# EAGLE design Radio_RPI (EAGLE 7.4.0)
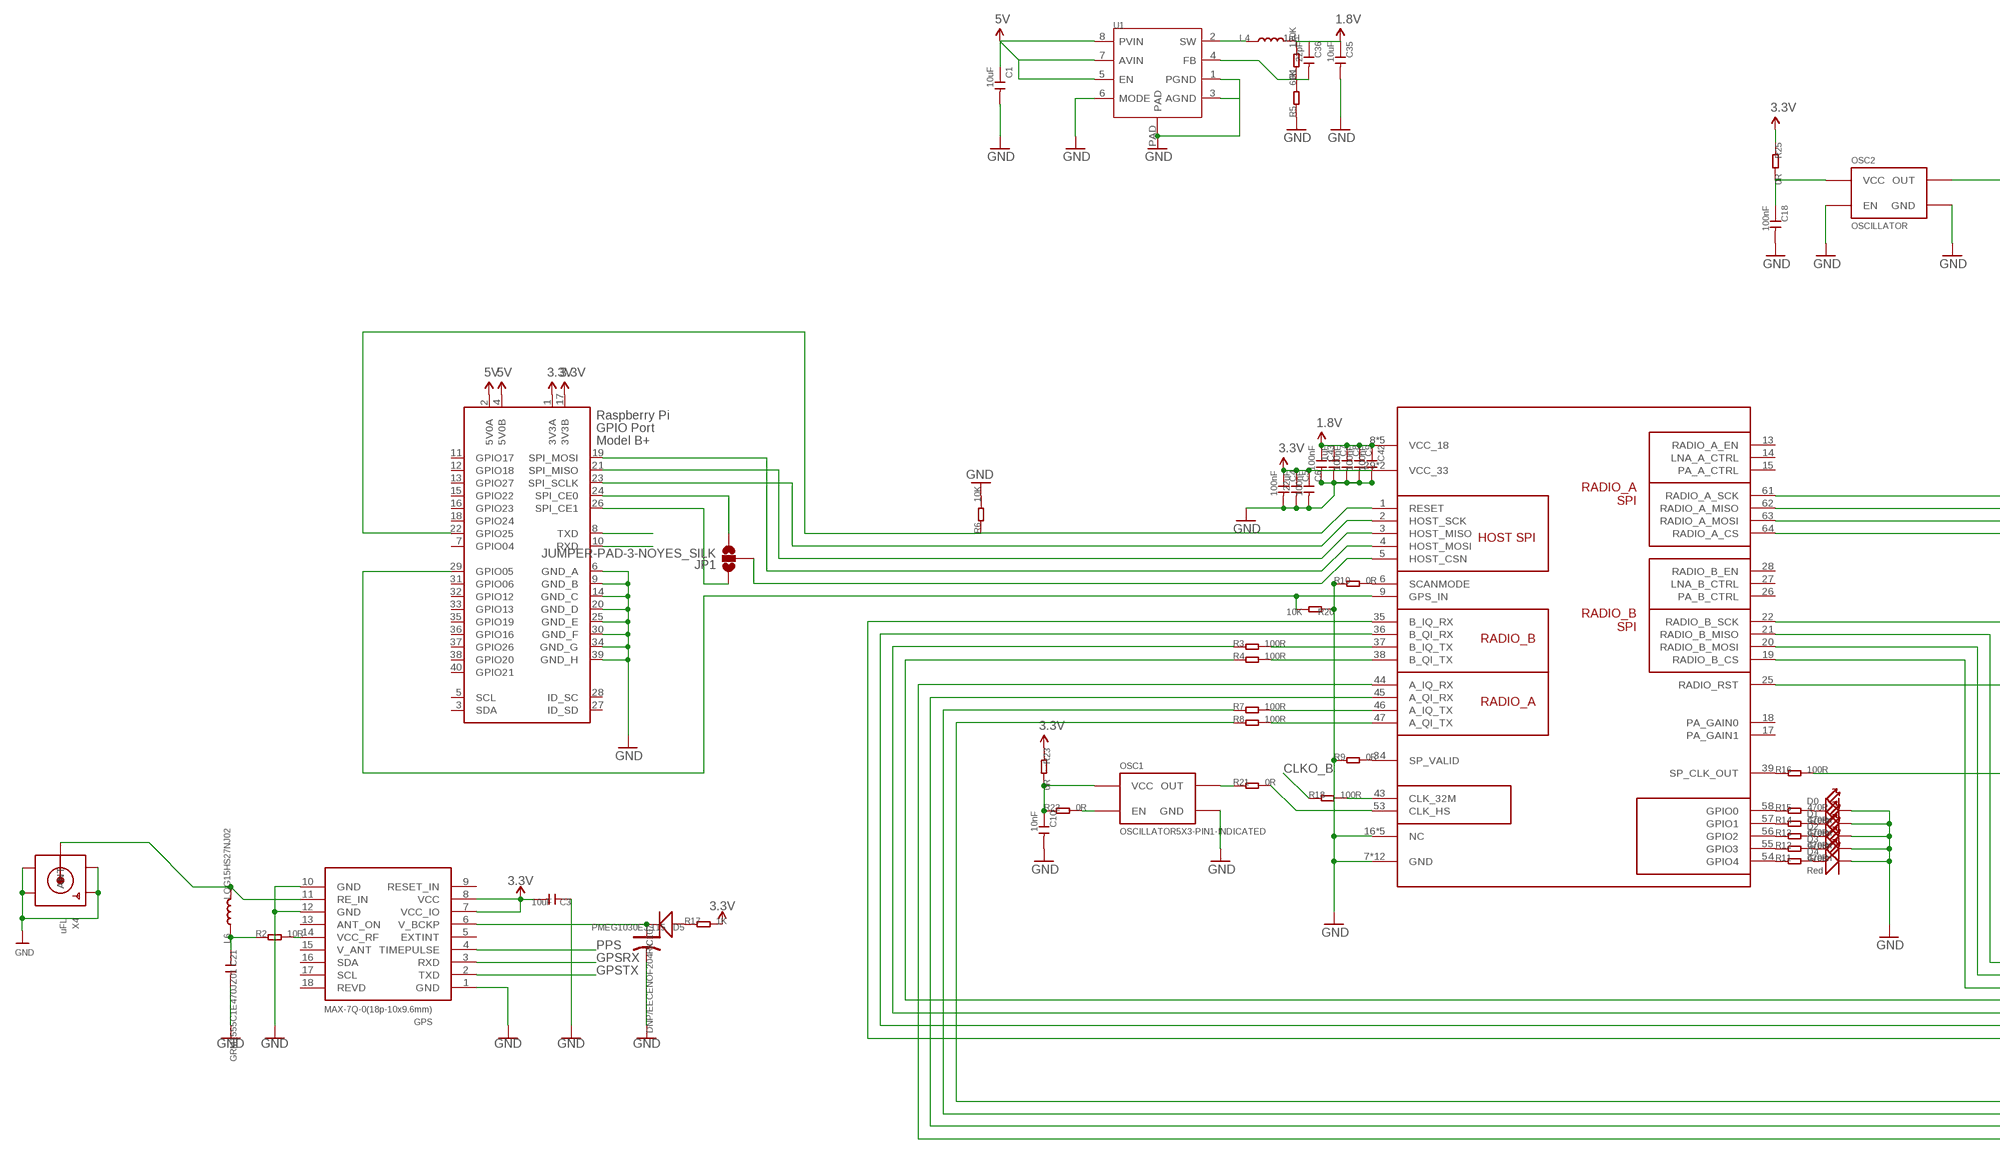
[diagram p0: schematic, sheet 1, part 1 of 2]
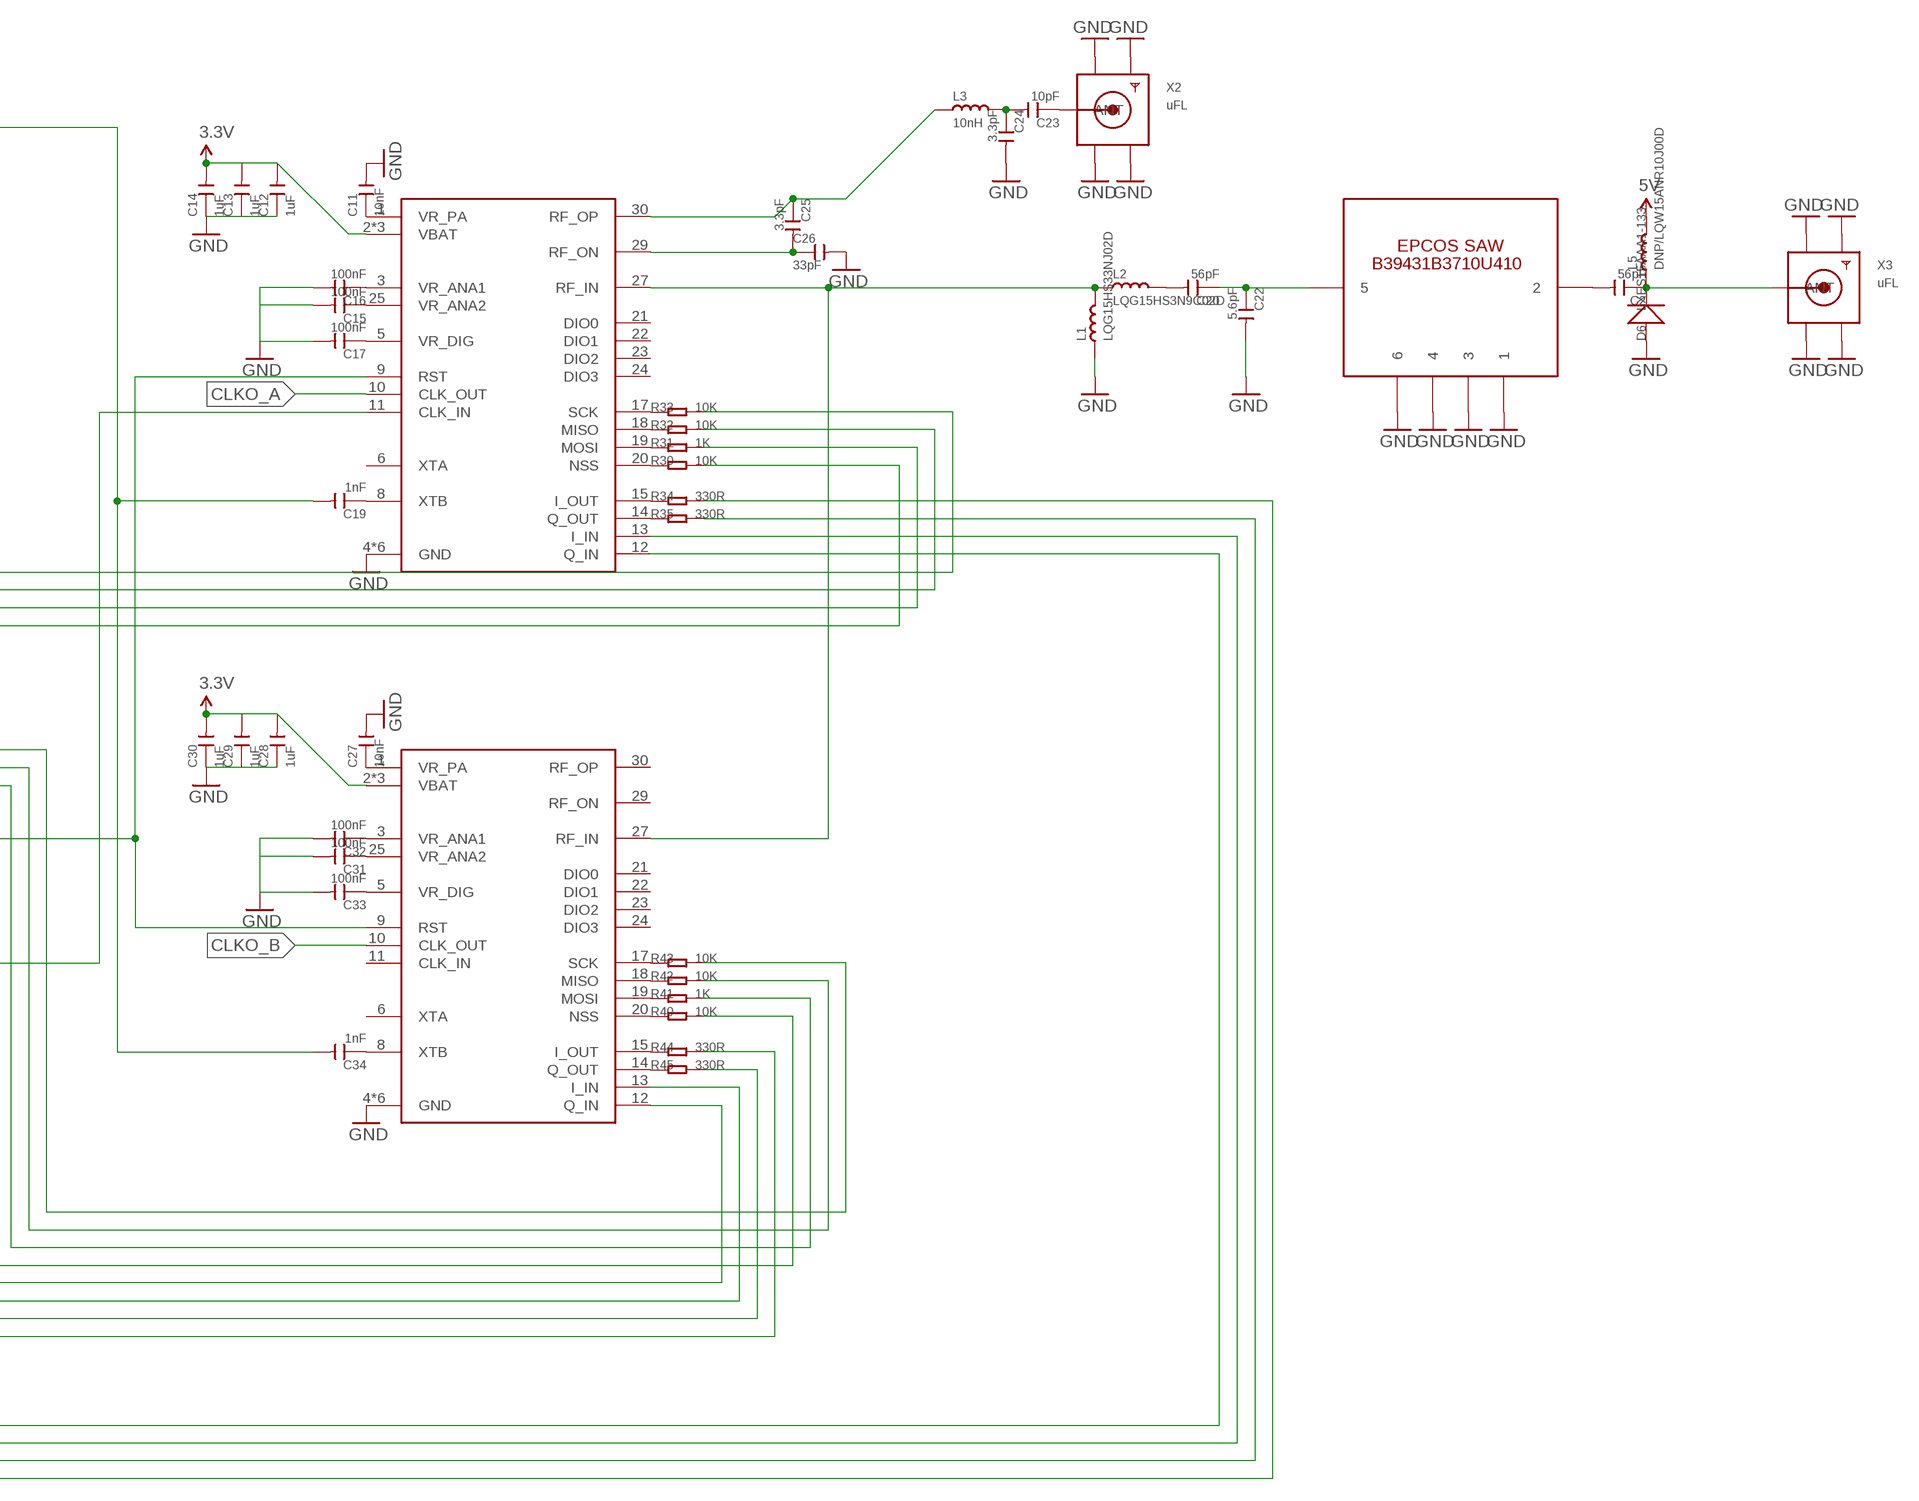
[diagram p1: schematic, sheet 1, part 2 of 2]

## Parts
C1  10uF  CAP-0603  [C0603@1]
C2  56pF  CAP-0402  [C0402@1]
C3  10uF  C-0603  [C0603]
C4  100nF  CAP-0402  [C0402@1]
C5  22uF  CAP-0603  [C0603@1]
C6  100nF  CAP-0402  [C0402@1]
C7  1uF  CAP-0402  [C0402@1]
C8  100nF  CAP-0402  [C0402@1]
C9  100nF  CAP-0402  [C0402@1]
C10  10nF  CAP-0402  [C0402@1]
C11  10nF  CAP-0402  [C0402@1]
C12  1uF  CAP-0402  [C0402@1]
C13  1uF  CAP-0402  [C0402@1]
C14  1uF  CAP-0402  [C0402@1]
C15  100nF  CAP-0402  [C0402@1]
C16  100nF  CAP-0402  [C0402@1]
C17  100nF  CAP-0402  [C0402@1]
C18  100nF  CAP-0402  [C0402@1]
C19  1nF  CAP-0402  [C0402@1]
C20  56pF  CAP-0402  [C0402@1]
C21  GRM1555C1E470JZ01  C-0402  [C0402]
C22  5.6pF  CAP-0402  [C0402@1]
C23  10pF  CAP-0402  [C0402@1]
C24  3.3pF  CAP-0402  [C0402@1]
C25  3.3pF  CAP-0402  [C0402@1]
C26  33pF  CAP-0402  [C0402@1]
C27  10nF  CAP-0402  [C0402@1]
C28  1uF  CAP-0402  [C0402@1]
C29  1uF  CAP-0402  [C0402@1]
C30  1uF  CAP-0402  [C0402@1]
C31  100nF  CAP-0402  [C0402@1]
C32  100nF  CAP-0402  [C0402@1]
C33  100nF  CAP-0402  [C0402@1]
C34  1nF  CAP-0402  [C0402@1]
C35  10uF  CAP-0603  [C0603@1]
C36  22pF  CAP-0402  [C0402@1]
C42  100nF  CAP-0402  [C0402@1]
C43  100nF  CAP-0402  [C0402@1]
C107  DNP/EECENOF204Rk  C-ELECTRIC-DOUBLE-LAYER-CAPACITOR  [2P-D6.8MMX1.8MMH]
D0  Green  LED-0603  [LED-0603]
D1  Green  LED-0603  [LED-0603]
D2  Green  LED-0603  [LED-0603]
D3  Green  LED-0603  [LED-0603]
D4  Red  LED-0603  [LED-0603]
D5  PMEG1030EJ,115  D'0805'  [SOD323]
D6  LXES15AAA1-133  D  [C0402]
GPS  MAX-7Q-0(18p-10x9.6mm)  MODULE-GPS-SMD-MAX-7Q-0(18P-9.6X10MM)  [GPS18P-SMD-1.1-10X9.6MM]
JP1  JUMPER-PAD-3-NOYES_SILK  [PAD-JUMPER-3-NO_YES_SILK]
L1  LQG15HS33NJ02D  INDUCTOR/FERRITE-BEAD-0402  [L0402@1]
L2  LQG15HS3N9C02D  INDUCTOR/FERRITE-BEAD-0402  [L0402@1]
L3  10nH  INDUCTOR/FERRITE-BEAD-0402  [L0402@1]
L4  1uH  L'1616BZ'  [1616BZ]
L5  DNP/LQW15ANR10J00D  INDUCTOR/FERRITE-BEAD-0402  [L0402@1]
L6  LQG15HS27NJ02  L'0402'  [L0402]
OSC1  OSCILLATOR5X3-PIN1-INDICATED  [CRYSTAL-OSC-SMD-5X3]
OSC2  OSCILLATOR  [CRYSTAL-OSC-SMD-3.2X2.5]
R1  120K  R-0402  [R0402]
R2  10R  R-0402  [R0402]
R3  100R  R-0402  [R0402]
R4  100R  R-0402  [R0402]
R5  60K  R-0402  [R0402]
R6  10K  R-0402  [R0402]
R7  100R  R-0402  [R0402]
R8  100R  R-0402  [R0402]
R9  0R  R-0402  [R0402]
R10  0R  R-0402  [R0402]
R11  470R  R-0402  [R0402]
R12  470R  R-0402  [R0402]
R13  470R  R-0402  [R0402]
R14  470R  R-0402  [R0402]
R15  470R  R-0402  [R0402]
R16  100R  R-0402  [R0402]
R17  1K  R-0402  [R0402]
R18  100R  R-0402  [R0402]
R20  10K  R-0402  [R0402]
R21  0R  R-0402  [R0402]
R22  0R  R-0402  [R0402]
R23  0R  R-0402  [R0402]
R25  0R  R-0402  [R0402]
R30  10K  R-0402  [R0402]
R31  1K  R-0402  [R0402]
R32  10K  R-0402  [R0402]
R33  10K  R-0402  [R0402]
R34  330R  R-0402  [R0402]
R35  330R  R-0402  [R0402]
R40  10K  R-0402  [R0402]
R41  1K  R-0402  [R0402]
R42  10K  R-0402  [R0402]
R43  10K  R-0402  [R0402]
R44  330R  R-0402  [R0402]
R45  330R  R-0402  [R0402]
U1  PMIC-ETA3410D2I-T(DFN8-2X2)WSON  [WSON]
U$1  SX1301  [QFN64G-0.5-9X9MM]
U$2  SX1255  [QFN32G-0.5-5X5MM]
U$3  SX1255  [QFN32G-0.5-5X5MM]
U$4  B39921B3728U410  EPCOS_SAW_FILTER  [EPCOS_SAW_FILTER]
X1  RASPI_BOARD_B+#_H  [RASPI_BOARD_B+HAT]
X2  uFL  SMACONNECTOR_EDGE_UFL  [SMA_EDGELAUNCH_UFL]
X3  uFL  SMACONNECTOR_EDGE_UFL  [SMA_EDGELAUNCH_UFL]
X4  uFL  SMACONNECTOR_EDGE_UFL  [SMA_EDGELAUNCH_UFL]

## Nets
1.8V: C7.1 C8.1 C9.1 C35.1 C36.1 C42.1 C43.1 L4.2 R1.2 U$1.8(VCC_18) U$1.12(VCC_18) U$1.23(VCC_18) U$1.42(VCC_18) U$1.60(VCC_18)
3.3V: C3.2 C4.1 C5.1 C6.1 C12.2 C13.2 C14.2 C28.2 C29.2 C30.2 GPS.7(VCC_IO) GPS.8(VCC) R17.2 R23.1 R25.1 U$1.29(VCC_33) U$1.52(VCC_33) U$2.2(VBAT) U$2.16(VBAT) U$2.32(VBAT) U$3.2(VBAT) U$3.16(VBAT) U$3.32(VBAT) X1.1(3V3A) X1.17(3V3B)
5V: C1.1 L5.2 U1.5(EN) U1.7(AVIN) U1.8(PVIN) X1.2(5V0A) X1.4(5V0B)
CLKO_A: U$2.10(CLK_OUT)
CLKO_B: R18.1 U$3.10(CLK_OUT)
CS: JP1.2 U$1.5(HOST_CSN)
FEWF: D4.+ R11.2
GND: C1.2 C3.1 C4.2 C5.2 C6.2 C7.2 C8.2 C9.2 C10.2 C11.2 C12.1 C13.1 C14.1 C15.2 C16.2 C17.2 C18.2 C21.2 C22.2 C24.2 C26.2 C27.2 C28.1 C29.1 C30.1 C31.2 C32.2 C33.2 C35.2 C42.2 C43.2 C107.- D0.- D1.- D2.- D3.- D4.- D6.1(+) GPS.1(GND) GPS.10(GND) GPS.12(GND) L1.1 OSC1.2(GND) OSC2.P$1(EN) OSC2.P$2(GND) R5.1 R6.2 R9.1 R10.1 R20.1 U1.1(PGND) U1.3(AGND) U1.6(MODE) U1.PAD U$1.7(GND) U$1.10(GND) U$1.11(GND) U$1.16(NC) U$1.24(GND) U$1.30(GND) U$1.31(GND) U$1.32(NC) U$1.33(NC) U$1.40(GND) U$1.41(GND) U$1.48(NC) U$1.49(NC) U$1.50(GND) U$1.51(GND) U$1.59(GND) U$1.65(GND) U$2.4(GND) U$2.7(GND) U$2.26(GND) U$2.28(GND) U$2.31(GND) U$2.33(GND) U$3.4(GND) U$3.7(GND) U$3.26(GND) U$3.28(GND) U$3.31(GND) U$3.33(GND) U$4.P$1 U$4.P$3 U$4.P$4 U$4.P$6 X1.6(GND_A) X1.9(GND_B) X1.14(GND_C) X1.20(GND_D) X1.25(GND_E) X1.30(GND_F) X1.34(GND_G) X1.39(GND_H) X2.GND@1(GND1) X2.GND@2(GND2) X2.GND@3(GND3) X2.GND@4(GND4) X3.GND@1(GND1) X3.GND@2(GND2) X3.GND@3(GND3) X3.GND@4(GND4) X4.GND@1(GND1) X4.GND@2(GND2) X4.GND@3(GND3) X4.GND@4(GND4)
GPSRX: GPS.3(RXD) X1.8(TXD)
GPSTX: GPS.2(TXD) X1.10(RXD)
MISO: U$1.3(HOST_MISO) X1.21(SPI_MISO)
MOSI: U$1.4(HOST_MOSI) X1.19(SPI_MOSI)
N$1: R30.1 U$2.20(NSS)
N$2: R45.2 U$1.36(B_QI_RX)
N$3: R3.2 U$1.37(B_IQ_TX)
N$4: R4.2 U$1.38(B_QI_TX)
N$5: R34.2 U$1.44(A_IQ_RX)
N$6: R7.2 U$1.46(A_IQ_TX)
N$7: R8.2 U$1.47(A_QI_TX)
N$8: R35.2 U$1.45(A_QI_RX)
N$9: R9.2 U$1.34(SP_VALID)
N$10: R10.2 U$1.6(SCANMODE)
N$11: C20.2 L2.2
N$12: R11.1 U$1.54(GPIO4)
N$13: R12.1 U$1.55(GPIO3)
N$14: R13.1 U$1.56(GPIO2)
N$15: R14.1 U$1.57(GPIO1)
N$16: R15.1 U$1.58(GPIO0)
N$17: C2.1 D6.2(-) L5.1 X3.P(ANT)
N$18: D3.+ R12.2
N$19: D1.+ R14.2
N$20: D0.+ R15.2
N$21: D2.+ R13.2
N$22: R16.1 U$1.39(SP_CLK_OUT)
N$24: C23.1 X2.P(ANT)
N$25: L4.1 U1.2(SW)
N$26: C36.2 R1.1 R5.2 U1.4(FB)
N$27: C21.1 L6.1 R2.1
N$28: JP1.3 X1.24(SPI_CE0)
N$29: C19.1 U$2.8(XTB)
N$30: R21.2 U$1.53(CLK_HS)
N$31: OSC1.3(OUT) R21.1
N$32: OSC1.1(EN) R22.2
N$33: C10.1 OSC1.4(VCC) R22.1 R23.2
N$34: GPS.14(VCC_RF) R2.2
N$35: C11.1 U$2.1(VR_PA)
N$36: C18.1 OSC2.P$4(VCC) R25.2
N$37: C19.2 C34.2 OSC2.P$3(OUT)
N$38: C15.1 U$2.25(VR_ANA2)
N$39: C16.1 U$2.3(VR_ANA1)
N$40: C17.1 U$2.5(VR_DIG)
N$41: GPS.11(RE_IN) L6.2 X4.P(ANT)
N$42: C107.+ D5.- GPS.6(V_BCKP)
N$43: D5.+ R17.1
N$44: C20.1 C22.1 U$4.P$5
N$45: R18.2 U$1.43(CLK_32M)
N$46: C2.2 U$4.P$2
N$49: L1.2 L2.1 U$2.27(RF_IN) U$3.27(RF_IN)
N$52: C23.2 C24.1 L3.2
N$53: C25.1 L3.1 U$2.30(RF_OP)
N$54: C25.2 C26.1 U$2.29(RF_ON)
N$56: R34.1 U$2.15(I_OUT)
N$57: R35.1 U$2.14(Q_OUT)
N$58: C27.1 U$3.1(VR_PA)
N$59: C31.1 U$3.25(VR_ANA2)
N$60: C32.1 U$3.3(VR_ANA1)
N$61: C33.1 U$3.5(VR_DIG)
N$62: C34.1 U$3.8(XTB)
N$78: R44.1 U$3.15(I_OUT)
N$79: R45.1 U$3.14(Q_OUT)
N$80: R33.2 U$1.61(RADIO_A_SCK)
N$81: R32.2 U$1.62(RADIO_A_MISO)
N$82: R31.2 U$1.63(RADIO_A_MOSI)
N$83: R30.2 U$1.64(RADIO_A_CS)
N$84: R43.2 U$1.22(RADIO_B_SCK)
N$85: R42.2 U$1.21(RADIO_B_MISO)
N$86: R41.2 U$1.20(RADIO_B_MOSI)
N$87: R40.2 U$1.19(RADIO_B_CS)
N$88: U$1.25(RADIO_RST) U$2.9(RST) U$3.9(RST)
N$89: R16.2 U$2.11(CLK_IN)
N$90: R44.2 U$1.35(B_IQ_RX)
N$91: R7.1 U$2.13(I_IN)
N$92: R3.1 U$3.13(I_IN)
N$93: R4.1 U$3.12(Q_IN)
N$94: R8.1 U$2.12(Q_IN)
N$95: JP1.1 X1.26(SPI_CE1)
N$100: R31.1 U$2.19(MOSI)
N$101: R32.1 U$2.18(MISO)
N$102: R33.1 U$2.17(SCK)
N$103: R40.1 U$3.20(NSS)
N$104: R41.1 U$3.19(MOSI)
N$105: R42.1 U$3.18(MISO)
N$106: R43.1 U$3.17(SCK)
PPS: GPS.4(TIMEPULSE) R20.2 U$1.9(GPS_IN) X1.29(GPIO05)
RST: R6.1 U$1.1(RESET) X1.22(GPIO25)
SCK: U$1.2(HOST_SCK) X1.23(SPI_SCLK)
Unconnected: GPS.5(EXTINT) GPS.9(RESET_IN) GPS.13(ANT_ON) GPS.15(V_ANT) GPS.16(SDA) GPS.17(SCL) GPS.18(REVD) U$1.13(RADIO_A_EN) U$1.14(LNA_A_CTRL) U$1.15(PA_A_CTRL) U$1.17(PA_GAIN1) U$1.18(PA_GAIN0) U$1.26(PA_B_CTRL) U$1.27(LNA_B_CTRL) U$1.28(RADIO_B_EN) U$2.6(XTA) U$2.21(DIO0) U$2.22(DIO1) U$2.23(DIO2) U$2.24(DIO3) U$3.6(XTA) U$3.11(CLK_IN) U$3.21(DIO0) U$3.22(DIO1) U$3.23(DIO2) U$3.24(DIO3) U$3.29(RF_ON) U$3.30(RF_OP) X1.3(SDA) X1.5(SCL) X1.7(GPIO04) X1.11(GPIO17) X1.12(GPIO18) X1.13(GPIO27) X1.15(GPIO22) X1.16(GPIO23) X1.18(GPIO24) X1.27(ID_SD) X1.28(ID_SC) X1.31(GPIO06) X1.32(GPIO12) X1.33(GPIO13) X1.35(GPIO19) X1.36(GPIO16) X1.37(GPIO26) X1.38(GPIO20) X1.40(GPIO21)

## Library data of the parts
C1 C2 C4-C20 C22-C36 C42 C43 = Discrete:CAP: Ceramic Capacitors
C3 C21 = Discrete:C*: Ceramic Capacitors
C107 = template:C-ELECTRIC-DOUBLE-LAYER-CAPACITOR: Electric Double Layer Capacitor DMS3R3204R,DMS3R3224R
D0 D1-D4 = Discrete:LED
D5 D6 = Discrete:D*
GPS = Seeed-OPL-Moudle:MODULE-GPS-SMD-MAX-7Q-0(18P-9.6X10MM): 317050009; MPN: MAX-7Q-0
JP1 = SparkFun-Passives:JUMPER-PAD-3-NO
L1-L3 L5 = Discrete:INDUCTOR/FERRITE-BEAD
L4 L6 = Discrete:L*
OSC1 OSC2 = SparkFun-FreqCtrl:OSCILLATOR: Generic 5x3 and 7x5 oscillators
R1-R18 R20-R23 R25 R30-R35 R40-R45 = Discrete:R*
U1 = Seeed-OPL-ic:PMIC-ETA3410D2I-T(DFN8-2X2): 310030161
U$1 = Seeed-OPL-ic:SX1301
U$2 U$3 = Seeed-OPL-ic:SX1255
U$4 = Ava:EPCOS_SAW_FILTER
X1 = raspberrypi_bastelstube_v13:RASPI_BOARD_B+#: Raspberry Pi GPIO connector with markings for the outer dimensions of the Raspberry Pi board model B+ with different sets of drill holes or mounting pads All pins connected
X2-X4 = microbuilder:SMACONNECTOR: SMA Connector 90° DIP SMA Connector, 50 Ohm (4UConnector: 07259)

## Board
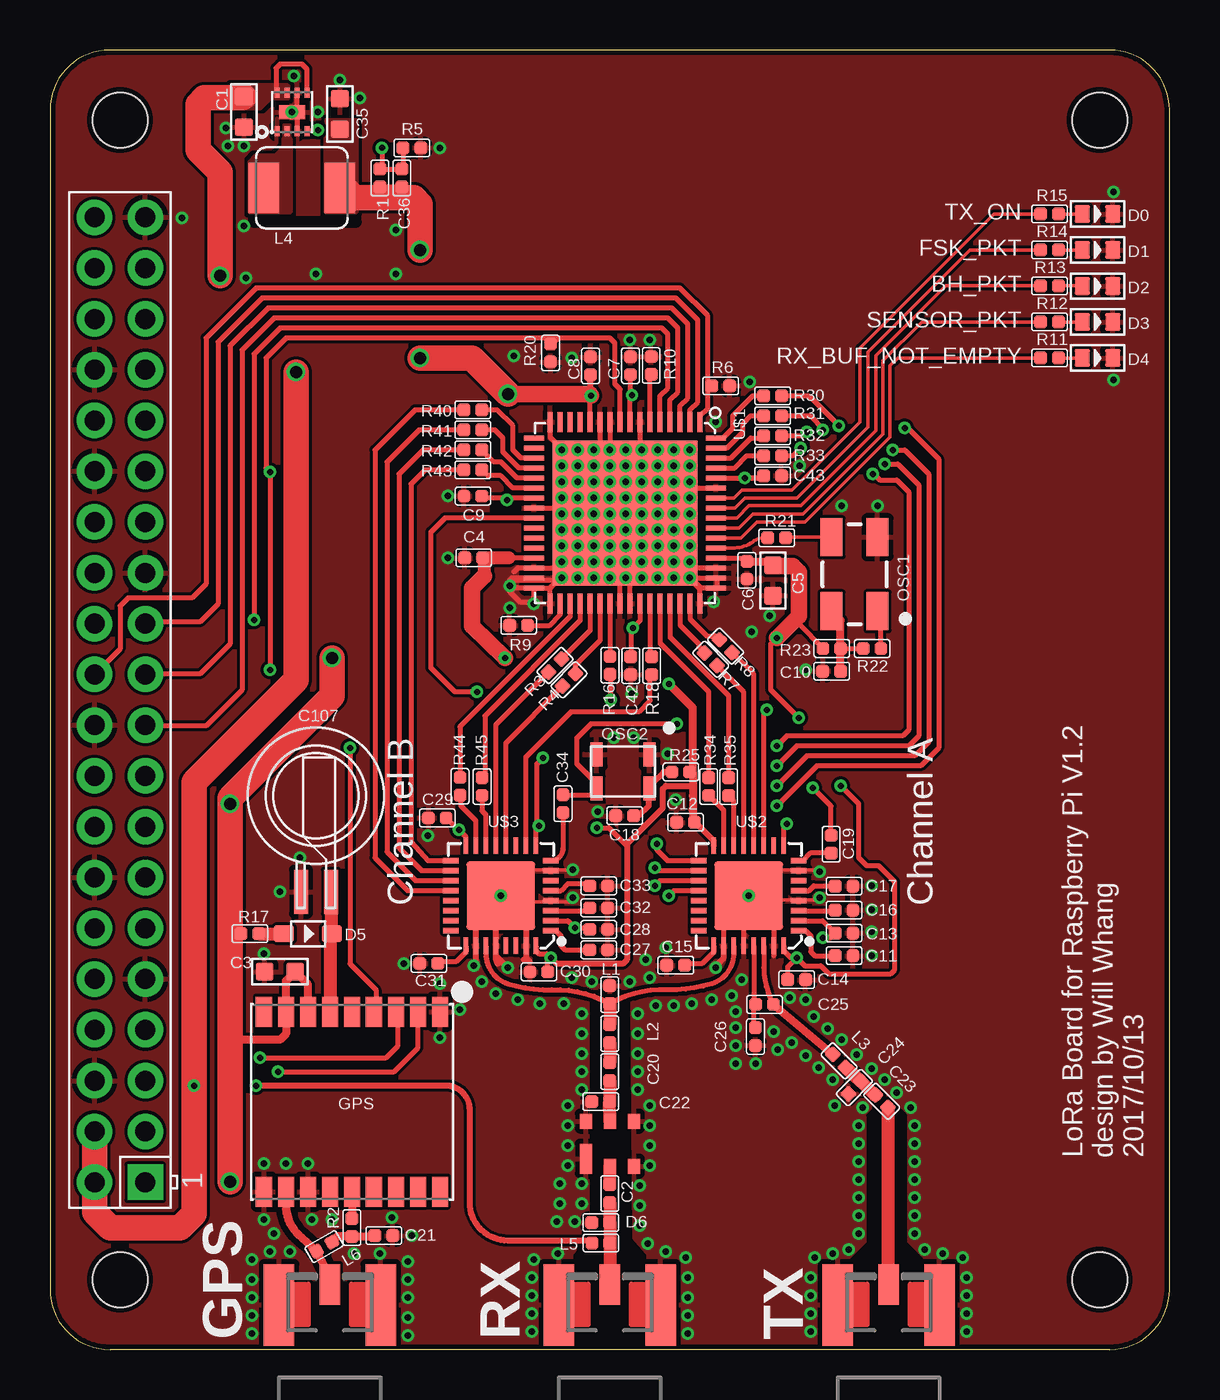
[diagram p2: board, top side]
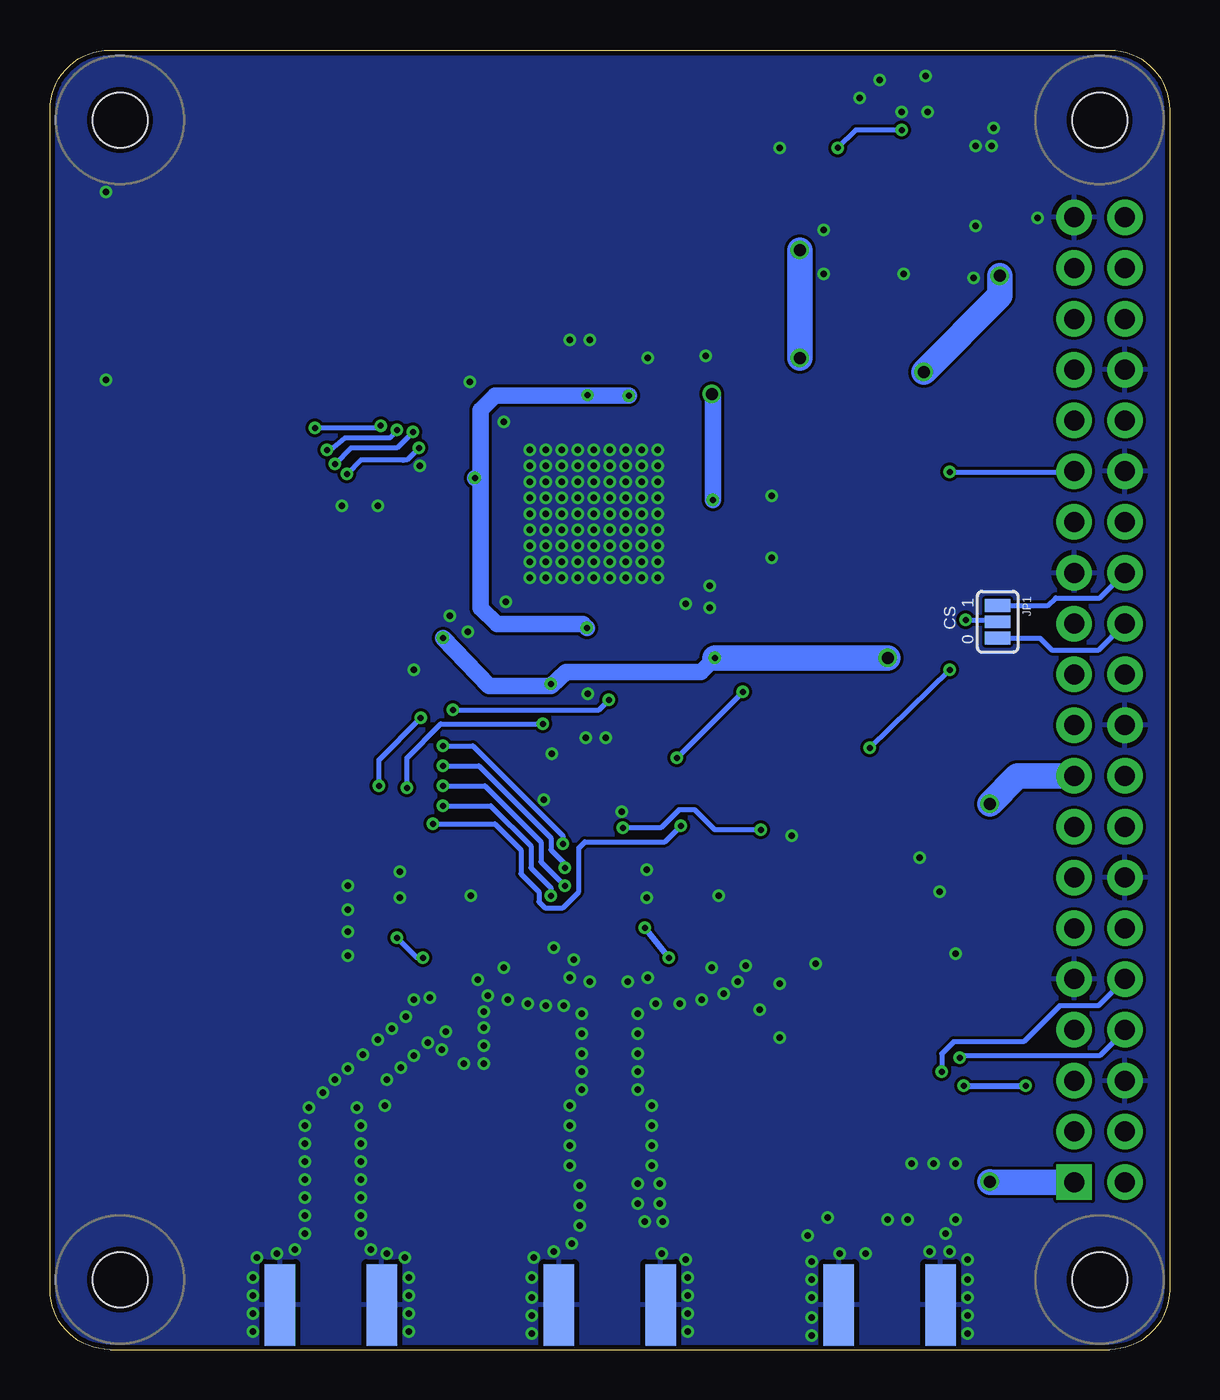
[diagram p3: board, bottom side, seen from below]

Size 56 x 65 mm. Coordinates in mm from the lower left corner, seen from the top.
Copper layers (1*16): Top 0.035mm / dielectric 1.5mm / Bottom 0.035mm
Design rules "SeeedStudio_2layer_DRU_no_angle_20140221 *": minimum track width 6mil, minimum drill 0.3mm, track to track 6mil, track to pad 6mil, pad to pad 6mil, via to via 6mil, smd to smd 0mil, copper to edge 10mil, drill to drill 10mil, minimum pad ring 10mil, minimum via ring 6mil, stop-mask expansion 2mil, vias tented up to drill 100mil, thermal gap 10mil
tRestrict: area 26.3,0.1 to 29.7,17.5; area 40.1,0.1 to 43.6,12; 31 lines

### Footprints (pad centres in the part's own frame; a part is rotated, then mirrored left to right if it is on the bottom)
C0603@1 = smd 0.889 x 0.889: 1 -0.762,0; 2 0.762,0
C0402@1 = smd 0.635 x 0.635: 1 -0.445,0; 2 0.445,0
C0603 = smd 0.889 x 0.889: 1 -0.762,0; 2 0.762,0
C0402 = smd 0.635 x 0.635: 1 -0.445,0; 2 0.445,0
2P-D6.8MMX1.8MMH = smd 2.2 x 0.7: + 4.8,0.75; - 4.8,-0.75
LED-0603 = smd 0.762 x 0.889: + -0.762,0; - 0.762,0
SOD323 = smd 1 x 0.8: + -1.2,0; - 1.2,0
GPS18P-SMD-1.1-10X9.6MM = smd 1.5 x 0.8: 1 -4.5,4.4; 2 -4.5,3.3; 3 -4.5,2.2; 4 -4.5,1.1; 5 -4.5,0; 6 -4.5,-1.1; 7 -4.5,-2.2; 8 -4.5,-3.3; 9 -4.5,-4.4; 10 4.5,-4.4; 11 4.5,-3.3; 12 4.5,-2.2; 13 4.5,-1.1; 14 4.5,0; 15 4.5,1.1; 16 4.5,2.2; 17 4.5,3.3; 18 4.5,4.4
PAD-JUMPER-3-NO_YES_SILK = smd 0.635 x 1.27: 1 -0.813,0; 2 0,0; 3 0.813,0
L0402@1 = smd 0.635 x 0.635: 1 -0.445,0; 2 0.445,0
1616BZ = smd 1.524 x 2.54: 1 -1.905,0; 2 1.905,0
L0402 = smd 0.635 x 0.635: 1 -0.445,0; 2 0.445,0
CRYSTAL-OSC-SMD-5X3 = smd 1.9 x 1.1: 1 -1.85,-1.15; 2 1.85,-1.15; 3 1.85,1.15; 4 -1.85,1.15
CRYSTAL-OSC-SMD-3.2X2.5 = smd 0.6 x 1.2: P$1 -1.325,-0.85; P$2 1.325,-0.85; P$3 1.325,0.85; P$4 -1.325,0.85
R0402 = smd 0.635 x 0.635: 1 -0.445,0; 2 0.445,0
WSON = smd 0.25 x 0.5: 1 -0.75,-0.95; 2 -0.25,-0.95; 3 0.25,-0.95; 4 0.75,-0.95; 5 0.75,0.95; 6 0.25,0.95; 7 -0.25,0.95; 8 -0.75,0.95 | smd 1.3 x 0.7: PAD 0,0
QFN64G-0.5-9X9MM = smd 1 x 0.25: 1 -4.55,3.75; 2 -4.55,3.25; 3 -4.55,2.75; 4 -4.55,2.25; 5 -4.55,1.75; 6 -4.55,1.25; 7 -4.55,0.75; 8 -4.55,0.25; 9 -4.55,-0.25; 10 -4.55,-0.75; 11 -4.55,-1.25; 12 -4.55,-1.75; 13 -4.55,-2.25; 14 -4.55,-2.75; 15 -4.55,-3.25; 16 -4.55,-3.75; 33 4.55,-3.75; 34 4.55,-3.25; 35 4.55,-2.75; 36 4.55,-2.25; 37 4.55,-1.75; 38 4.55,-1.25; 39 4.55,-0.75; 40 4.55,-0.25; 41 4.55,0.25; 42 4.55,0.75; 43 4.55,1.25; 44 4.55,1.75; 45 4.55,2.25; 46 4.55,2.75; 47 4.55,3.25; 48 4.55,3.75 | smd 0.25 x 1: 17 -3.75,-4.55; 18 -3.25,-4.55; 19 -2.75,-4.55; 20 -2.25,-4.55; 21 -1.75,-4.55; 22 -1.25,-4.55; 23 -0.75,-4.55; 24 -0.25,-4.55; 25 0.25,-4.55; 26 0.75,-4.55; 27 1.25,-4.55; 28 1.75,-4.55; 29 2.25,-4.55; 30 2.75,-4.55; 31 3.25,-4.55; 32 3.75,-4.55; 49 3.75,4.55; 50 3.25,4.55; 51 2.75,4.55; 52 2.25,4.55; 53 1.75,4.55; 54 1.25,4.55; 55 0.75,4.55; 56 0.25,4.55; 57 -0.25,4.55; 58 -0.75,4.55; 59 -1.25,4.55; 60 -1.75,4.55; 61 -2.25,4.55; 62 -2.75,4.55; 63 -3.25,4.55; 64 -3.75,4.55 | smd 7.25 x 7.25: 65 0,0
QFN32G-0.5-5X5MM = smd 0.813 x 0.279: 1 -2.5,1.75; 2 -2.5,1.25; 3 -2.5,0.75; 4 -2.5,0.25; 5 -2.5,-0.25; 6 -2.5,-0.75; 7 -2.5,-1.25; 8 -2.5,-1.75; 17 2.5,-1.75; 18 2.5,-1.25; 19 2.5,-0.75; 20 2.5,-0.25; 21 2.5,0.25; 22 2.5,0.75; 23 2.5,1.25; 24 2.5,1.75 | smd 0.279 x 0.813: 9 -1.75,-2.5; 10 -1.25,-2.5; 11 -0.75,-2.5; 12 -0.25,-2.5; 13 0.25,-2.5; 14 0.75,-2.5; 15 1.25,-2.5; 16 1.75,-2.5; 25 1.75,2.5; 26 1.25,2.5; 27 0.75,2.5; 28 0.25,2.5; 29 -0.25,2.5; 30 -0.75,2.5; 31 -1.25,2.5; 32 -1.75,2.5 | smd 3.429 x 3.429: 33 0,0
EPCOS_SAW_FILTER = smd 0.6 x 1.5: P$1 1.2,0.75 | smd 0.6 x 0.75: P$2 0,1.125; P$3 -1.2,1.125; P$4 -1.2,-1.125; P$5 0,-1.125; P$6 1.2,-1.125
RASPI_BOARD_B+HAT = drill 1 pad 1.778 square: 1 8.37,51.23 | drill 1 pad 1.778: 2 8.37,53.77; 3 10.91,51.23; 4 10.91,53.77; 5 13.45,51.23; 6 13.45,53.77; 7 15.99,51.23; 8 15.99,53.77; 9 18.53,51.23; 10 18.53,53.77; 11 21.07,51.23; 12 21.07,53.77; 13 23.61,51.23; 14 23.61,53.77; 15 26.15,51.23; 16 26.15,53.77; 17 28.69,51.23; 18 28.69,53.77; 19 31.23,51.23; 20 31.23,53.77; 21 33.77,51.23; 22 33.77,53.77; 23 36.31,51.23; 24 36.31,53.77; 25 38.85,51.23; 26 38.85,53.77; 27 41.39,51.23; 28 41.39,53.77; 29 43.93,51.23; 30 43.93,53.77; 31 46.47,51.23; 32 46.47,53.77; 33 49.01,51.23; 34 49.01,53.77; 35 51.55,51.23; 36 51.55,53.77; 37 54.09,51.23; 38 54.09,53.77; 39 56.63,51.23; 40 56.63,53.77 | hole 2.75: 3.5,3.5; 3.5,52.5; 61.5,3.5; 61.5,52.5
SMA_EDGELAUNCH_UFL = smd 4.064 x 1.524: GND@1 2.032,-2.54; GND@2 2.032,2.54 | smd 4.064 x 1.524 bottom: GND@3 2.032,2.54; GND@4 2.032,-2.54 | smd 2.032 x 1.016: P 3.048,0

### Placement (x,y rotation side)
C1  9.7,61.9 270 top
C2  28,7.8 90 top
C3  11.5,18.9 0 top
C4  21.19,39.6 180 top
C5  36.16,38.47 270 top
C6  34.86,38.98 270 top
C7  29.04,49.21 90 top
C8  27.04,49.2 90 top
C9  21.16,42.69 180 top
C10  39.1,33.93 180 top
C11  39.72,19.7 0 top
C12  31.79,26.37 0 top
C13  39.72,20.83 180 top
C14  37.35,18.5 180 top
C15  31.3,19.22 180 top
C16  39.72,21.98 0 top
C17  39.72,23.18 0 top
C18  28.75,26.7 180 top
C19  39.07,25.27 90 top
C20  28,13.9 90 top
C21  16.7,5.7 0 top
C22  27.55,12.4 180 top
C23  41.6,12.42 135 top
C24  40.24,13.1 225 top
C25  35.74,17.26 180 top
C26  35.29,15.65 270 top
C27  27.45,19.99 0 top
C28  27.45,21.01 180 top
C29  19.37,26.59 0 top
C30  24.46,18.89 0 top
C31  18.95,19.31 180 top
C32  27.45,22.09 0 top
C33  27.45,23.19 0 top
C34  25.66,27.3 90 top
C35  14.5,61.8 90 top
C36  17.6,58.6 90 top
C42  29.05,34.2 270 top
C43  36.15,43.7 0 top
C107  13.3,27.7 270 top
D0  52.4,56.8 0 top
D1  52.4,55 0 top
D2  52.4,53.19 0 top
D3  52.4,51.4 0 top
D4  52.4,49.6 0 top
D5  12.9,20.8 0 top
D6  27.55,6.35 0 top
GPS  15.1,12.4 270 top
JP1  8.6,36.4 270 bottom
L1  28,17.75 270 top
L2  28,15.8 270 top
L3  39.47,14.44 315 top
L4  12.6,58.1 0 top
L5  27.56,5.33 180 top
L6  13.71,5.15 210 top
OSC1  40.24,38.78 90 top
OSC2  28.67,28.92 180 top
R1  16.5,58.6 270 top
R2  15.1,6.1 90 top
R3  25.26,34.21 45 top
R4  25.96,33.5 45 top
R5  18.1,60.1 180 top
R6  33.55,48.2 0 top
R7  33.06,34.52 135 top
R8  33.79,35.19 135 top
R9  23.44,36.22 0 top
R10  30.07,49.22 270 top
R11  50,49.6 0 top
R12  50,51.4 0 top
R13  50,53.2 0 top
R14  50,55 0 top
R15  50,56.8 0 top
R16  28.01,34.22 270 top
R17  10,20.8 180 top
R18  30.1,34.2 90 top
R20  25.04,49.84 90 top
R21  36.35,40.6 180 top
R22  41.12,35.06 0 top
R23  39.11,35.06 0 top
R25  31.56,28.89 180 top
R30  36.15,47.7 180 top
R31  36.15,46.7 180 top
R32  36.15,45.7 180 top
R33  36.15,44.7 180 top
R34  32.95,28.16 90 top
R35  33.95,28.15 90 top
R40  21.15,47 0 top
R41  21.15,46 0 top
R42  21.15,45 0 top
R43  21.15,44 0 top
R44  20.51,28.17 90 top
R45  21.61,28.16 90 top
U1  12.1,61.9 0 top
U$1  28.77,41.85 270 top
U$2  34.95,22.7 180 top
U$3  22.55,22.7 180 top
U$4  28,10.3 180 top
X1  56,0 90 top
X2  41.95,0.2 90 top
X3  28,0.2 90 top
X4  14,0.2 90 top

### Tracks (layer width: path | path; a pad name or v marks a point on that pad's centre or on a via)
1.8V  (via drill 0.3, 0.6)
  Top 0.254: U$1.42 29.52,36.47 v29.15,36.1 29.05,36 C42.1 | U$1.23 22.95,42.6 | 22.95,42.6 21.71,42.6 C9.1 | U$1.8 29.02,47.67 29.05,47.7 | 29.05,47.7 v29.12,47.73 29.15,47.7 29.05,47.7 | C7.1 29.02,48.74 29.02,47.73 29.05,47.7 | U$1.12 27.02,48.74 C8.1 27.04,47.89 | 27.04,47.89 v27.05,47.7 | v27.05,47.7 27.05,47.5 | v27.05,47.7 27.05,47.9 27.04,47.89 | v22.85,42.5 22.95,42.6 | U$1.60 v34.75,43.6 | v34.75,43.6 35.6,43.6 C43.1 35.71,43.66 35.65,43.6 v34.75,43.6 | R1.2 C36.1
  Top 0.406: C36.1 17.6,57.7 17.7,57.6
  Top 0.813: v22.9,47.8 27,47.8 v27.05,47.7
  Top 1.27: L4.2 14.7,58.1 15.2,57.6 17.7,57.6 18.2,57.6 18.5,57.3 v18.5,55 | v18.5,49.6 21.1,49.6 v22.9,47.8
  Bottom 0.254: v29.12,47.73 27.08,47.73 v27.05,47.7
  Bottom 0.813: v22.85,42.5 22.85,47.7 v22.9,47.8 | v27.05,47.7 33.75,47.7 34.45,47 34.45,43.6 | v34.75,43.6 34.45,43.6 | 34.45,43.6 34.45,37.1 33.65,36.3 29.35,36.3 v29.15,36.1
  Bottom 1.27: v18.5,55 v18.5,49.6
  pour Top (no thermals): 13.8,61.5 15.3,61.5 15.3,56.9 13.8,56.9
3.3V  (via drill 0.3, 0.6)
  Top 0.254: U$2.2 38.66,21.45 C13.2 39.05,20.6 v38.65,20.6 | U$1.52 34.68,39.6 C6.1 | U$1.29 22.95,39.6 | U$3.2 25.9,21.45 v26.25,21.1 26.92,21.1 C28.2 | U$3.32 24.3,19.95 24.45,19.8 24.85,19.8 v25.05,19.6 24.89,19.45 C30.2 | 37.45,36.7 37.45,36.28 R23.1 | 32.15,27.7 32.05,27 32.15,26.9 | C12.2 32.18,26.37 32.15,26.4 | U$2.32 36.7,19.95 37.05,19.6 v37.35,19.6 | v37.35,19.6 36.91,19.16 C14.2 | v37.35,19.6 37.75,19.2 38.55,19.2 38.95,18.8 42.05,18.8 42.25,19 42.25,23.4 41.45,24.2 40.85,24.2 40.45,24.6 40.45,27.3 v39.55,28.2 | v37.45,31.6 36.05,33 36.05,35.3 v36.35,35.6 | C29.2 20.8,25.61 U$3.16 20.8,25.65 v20.45,26 | v27.35,26.1 27.95,26.1 28.85,25.2 | 21.7,39.58 21.65,39.58 C4.1
  Top 0.305: C12.2 32.28,26.37 | 31.91,28.9 R25.1 | U$2.16 33.2,25.45 32.28,26.37 | 32.28,26.37 32.25,26.4 | v25.05,19.6 25.35,19.3 28.65,19.3 28.85,19.5 28.85,25.2 28.85,25.3 30.65,27.1 30.65,28.05 30.8,28.2 32.15,28.2 | v26.25,21.1 26.25,21.25
  Top 0.406: C6.1 35.97,39.42 C5.1 | 32.15,28.9 32.15,28.2 32.15,27.7 32.15,26.9 32.15,26.4 32.15,26.3 | 31.91,28.9 32.15,28.9 | 32.15,28.9 32.15,32.1 v30.95,33.3 | GPS.7 12.9,18.26 C3.2 11.8,18.44 GPS.8 11.8,15.8 11.5,15.5 9,15.5
  Top 0.64: 21.7,39.58 21.7,38.7 | 22.95,39.6 C4.1 | R17.2 9.2,20.8 9,20.6
  Top 0.813: v36.35,35.6 37.45,36.7 37.45,38.9 37.15,39.2 36.19,39.2 C5.1 | v22.75,34.6 21.1,36.2 21.1,38.1 21.7,38.7
  Top 1.27: v9,8.4 9,15.5 9,20.6 v9,27.3 9,27.6 14.1,32.7 v14.1,34.6
  Bottom 0.254: v37.35,19.6 37.65,19.6 v38.65,20.6 | v39.55,28.2 39.55,29.5 v37.45,31.6 | v20.45,26 22.75,26 23.75,27 24.55,27 25.45,26.1 v27.35,26.1
  Bottom 0.305: v25.05,19.6 v26.25,21.1
  Bottom 0.406: v30.95,33.3 30.95,33.2
  Bottom 0.813: v22.75,34.6 23.45,33.9 30.2,33.9 30.95,33.2 34.05,33.2 v36.35,35.6
  Bottom 1.27: X1.1 8.97,8.37 v9,8.4 | v14.1,34.6 v22.75,34.6 | X1.17 7.61,28.69 v9,27.3
5V  (via drill 0.3, 0.6)
  Top 0.254: U1.5 12.85,64.05 12.6,64.3 11.5,64.3 11.3,64.1 11.3,62.9 U1.8
  Top 0.305: L5.2 26.89,5.45 22.9,5.45 arc-90 21,7.35 21,12 arc90 19.8,13.2 v10.3,13.2
  Top 1.27: X1.4 X1.2 2.23,6.87 3,6.1 6.5,6.1 7.2,6.8 v7.2,13.2 7.2,28.4 12.3,33.5 v12.3,48.9 | v8.5,53.7 8.5,58.9 7.4,60 7.4,62.3 7.7,62.6 9.64,62.6 C1.1
  Bottom 0.305: v10.3,13.2 v7.2,13.2
  Bottom 1.27: v12.3,48.9 8.5,52.7 v8.5,53.7
  pour Top (no thermals): 9.1,62.1 10.5,62.1 11,62.6 11.9,62.6 11.9,63.2 9.1,63.2
CLKO_B
  Top 0.254: U$3.10 23.8,29.65 26.05,31.9 29.45,31.9 30.02,32.47 30.02,33.67 R18.1
CS  (via drill 0.3)
  Top 0.254: U$1.5 30.52,47.72 30.9,48.1 30.9,50.8 30.6,51.1 11.5,51.1 10.2,49.8 v10.2,36.5
  Bottom 0.254: v10.2,36.5 8.8,36.5 8.7,36.4 JP1.2
FEWF
  Top 0.178: R11.2 D4.+
GND  (via drill 0.33)
  Top 0.178: 26.2,24 24.1,24 24,23.9 24,22.4 26.1,22.4 26.2,22.5 | 38.3,22.5 36.2,22.5 36.1,22.5 36.1,23.7 | 36.1,23.9 36.1,24 36.2,24 | 38.7,24 36.2,24 | 36.2,24 36.1,23.9 | 36.1,23.9 36.1,23.7 | 36.1,23.7 36.2,23.6 | 27.85,45.1 27.5,45.1 27.43,45.17
  Top 0.254: U$1.16 25.02,45.63 25.55,45.1 | U$1.11 27.52,45.27 27.43,45.17 27.35,45.1 25.55,45.1 | U$1.10 28.02,45.27 27.85,45.1 29.45,45.1 29.55,45.2 29.52,45.23 U$1.7 | U$1.24 25.85,42.1 | 25.85,42.1 25.85,39.3 | 25.85,39.3 25.65,39.1 U$1.30 23.4,39.1 23.2,38.9 | U$1.40 28.52,38.67 | 28.52,38.67 28.55,38.7 | 25.85,39.3 26.1,39.3 | 26.1,39.3 27.89,39.3 | 27.89,39.3 28.52,38.67 | 29.02,38.47 29.25,38.6 31.45,38.6 31.55,38.7 31.75,38.5 32.05,38.5 32.25,38.3 | U$1.48 32.52,38.03 32.25,38.3 | U$1.51 31.85,39.1 31.85,39 32.25,38.6 33.35,38.6 33.35,38.2 33.25,38.1 32.55,38.1 32.35,38.3 32.25,38.3 | U$1.41 29.02,38.47 | 29.02,38.47 29.02,38.57 29.15,38.7 29.15,41.2 28.65,41.7 28.65,41.8 28.75,41.9 | 25.55,45.1 25.55,42.4 25.85,42.1 | 27.89,39.3 27.89,40.97 U$1.65 30.7,41.85 31.95,43.1 U$1.59 33.35,43.1 | U$2.26 33.7,21.5 34.7,21.5 | 34.7,20 34.7,21.5 | 34.7,21.5 36.2,21.5 | 36.2,21.5 36.2,19.7 | 36.2,21.5 36.2,22.5 | U$1.31 23.1,38.6 23,38.5 25.3,38.5 26.1,39.3 | U$1.32 23.2,38.1 23,37.9 23.5,37.4 24.1,37.4 24.2,37.5 24.2,38 24.3,38.1 25,38.1 | 25,37.3 25,38.1 | 25,38.1 25.5,38.6 | C4.2 20.7,39.6 | 12.35,61.9 U1.3 | U1.PAD 12.35,61.9 | 12.35,61.9 U1.6
  Top 0.305: v33.3,19.1 33.3,19.2 33.7,19.6 U$2.26 | 22.7,19.3 22.4,19.6 | 22.3,19.7 22.3,19.6 arc37 22.4,19.3 22.4,19.6 | 22.4,19.6 22.3,19.7 | 22.3,19.7 22.3,21.3 22.5,21.5 21.3,21.5 21.3,21.3 | 21.3,19.4 21.3,19.3 v21.2,19.2 21.2,19.3 21.3,19.4 | 21.3,19.4 21.3,21.3 | 21.3,21.3 21.4,21.4 23.7,21.4 23.8,21.3 | 23.8,21.3 23.8,19.6 | 23.7,19.5 23.8,19.6 | 24,19.4 23.8,19.6 | 23.8,21.3 23.8,22.3 24,22.5 | 24,22.5 24,22.4 | 24,22.5 24,23.8 24.1,23.9
  other vias: 41.1,19.7 25.5,8.3 6.6,56.6 9.7,56.2 41.1,20.9 41.1,22 41.1,23.2 37.8,17.5 38.5,23.9 34.95,22.7 22.55,22.7 18.9,25.7 17.7,19.3 28.2,30.6 29.2,30.6 30.9,29.8 29.1,32.8 36,36.7 35.1,35.9 33.2,37.4 37.8,34 41.4,42.2 39.6,42.2 29,50.5 30,50.5 26.1,49.6 19.5,60.1 13.4,61.9 14.5,63.5 15.5,62.6 8.8,61.1 9.7,60.2 8.9,60.2 22.3,17.8 23.4,17.5 24.5,17.3 25.7,17.3 26.6,16.8 26.6,15.8 26.6,14.8 26.6,13.9 30.8,20.1 29.8,19.5 38.5,22.6 26.6,7.3 25.35,6.4 29.5,6.2 29.9,5.3 29.5,8.2 26.6,13 25.9,12.2 25.9,10.2 25.9,9.2 25.9,11.2 26.6,8.3 25.4,4.8 24.2,4.5 24.1,3.6 24.1,2.7 24.1,1.8 24.1,0.9 34.6,18.5 34.1,17.7 33.1,17.5 32.1,17.3 31.2,17.2 29.4,16.8 29.4,15.8 29.4,14.8 29.4,13.9 29.4,13 30,12.2 30,11.2 30,10.2 30,9.2 29.5,7.2 30.8,4.9 31.8,4.6 31.9,3.6 31.9,2.6 31.9,1.7 31.9,0.8 34.3,15.2 34.3,16.1 34.3,16.9 35.3,14.3 34.3,14.3 36.2,15.9 36.4,15 37.1,15.35 39.15,13.5 39.25,12.2 40.65,12.1 40.45,11.2 40.45,10.3 40.45,9.4 40.45,8.5 40.45,7.6 40.45,6.7 40.45,5.8 39.95,5 39.15,4.8 38.25,4.6 38.05,3.6 38.05,2.7 38.05,1.8 38.05,0.9 45.85,0.9 45.85,1.8 45.85,2.7 45.85,3.6 45.65,4.6 44.65,4.8 43.75,5 43.25,5.8 43.25,6.7 43.25,7.6 43.25,8.5 43.25,9.4 43.25,10.3 43.25,11.2 43.05,12.1 42.35,12.85 41.75,13.5 38.45,14.1 41.1,14.05 37.8,14.7 40.35,14.75 39.6,15.5 19.9,39.6 26.15,22.6 26.15,24 24.2,37.3 23,38.2 25.6,45 25.6,44.2 26.4,45 26.4,44.2 25.6,43.4 26.4,43.4 27.2,45 27.2,44.2 28,45 28,44.2 27.2,43.4 28,43.4 28.8,45 28.8,44.2 29.6,45 29.6,44.2 28.8,43.4 29.6,43.4 30.4,45 30.4,44.2 31.2,45 31.2,44.2 30.4,43.4 31.2,43.4 32,45 32,44.2 32,43.4 25.6,40.2 25.6,39.4 26.4,40.2 26.4,39.4 25.6,38.6 26.4,38.6 27.2,40.2 27.2,39.4 28,40.2 28,39.4 27.2,38.6 28,38.6 28.8,40.2 28.8,39.4 29.6,40.2 29.6,39.4 28.8,38.6 29.6,38.6 30.4,40.2 30.4,39.4 31.2,40.2 31.2,39.4 30.4,38.6 31.2,38.6 32,40.2 32,39.4 32,38.6 25.6,42.6 25.6,41.8 26.4,42.6 26.4,41.8 25.6,41 26.4,41 27.2,42.6 27.2,41.8 28,42.6 28,41.8 27.2,41 28,41 28.8,42.6 28.8,41.8 29.6,42.6 29.6,41.8 28.8,41 29.6,41 30.4,42.6 30.4,41.8 31.2,42.6 31.2,41.8 30.4,41 31.2,41 32,42.6 32,41.8 32,41 37.5,44.2 19.9,42.7 27.4,26.9 31.3,27.5 9.8,53.6 17.3,53.8 13.3,53.8 17.3,56 23.2,49.7 35,48.4 33.3,46.4 23,37.1 53.2,48.5 53.2,57.9 10.7,19.8 19.5,15.6 20.5,17 19.5,18.3 11.5,22.9 12.5,24.6 10.7,6.5 11.2,5.8 12,4.9 13.1,6.5 14.1,6.5 18.1,5.7 17.1,6.6 10.7,9.3 12.9,9.3 11.8,9.3 10.1,4.5 10.1,3.5 10.1,2.6 10.1,1.7 10.1,0.8 17.9,4.4 17.9,3.5 17.9,2.6 17.9,1.6 17.9,0.7 16.5,4.8 15.2,4.8 11,4.9 26.25,6.4 25.5,7.3 12.1,61.9 12.2,63.7 22.9,19.1 29,18.4 27.1,18.4 26.1,18.6 30.3,17.2 30,18.6 21.6,18.4 38.9,16.05 38.2,16.65 37,17.6
  pour Bottom: 56,65 -0.3,65 0,0 56,0
  pour Top (rank 2): 56,65 -0.3,65 0,0 56,0
GPSRX  (via drill 0.3)
  Top 0.254: v10.5,14.6 16.8,14.6 17.4,15.2 17.4,16.8 GPS.3
  Bottom 0.254: X1.8 2.23,15.97 3.5,14.7 10.4,14.7 v10.5,14.6
GPSTX  (via drill 0.3)
  Top 0.254: v11.4,13.9 17.2,13.9 18.4,15.1 GPS.2
  Bottom 0.254: X1.10 3.56,17.2 5.5,17.2 7.3,15.4 10.8,15.4 11.4,14.8 v11.4,13.9
MISO
  Top 0.254: U$1.3 31.52,47.22 31.9,47.6 31.9,51.3 31.1,52.1 10.9,52.1 9,50.2 9,35.3 7.5,33.8 4.8,33.8 X1.21
MOSI
  Top 0.254: U$1.4 31.02,47.52 31.4,47.9 31.4,51.1 30.9,51.6 11.2,51.6 9.6,50 9.6,33 7.8,31.2 4.8,31.2 X1.19
N$1  (via drill 0.3)
  Top 0.254: R30.1 37.95,47.7 v39.45,46.2 | v42.75,46.1 42.9,46.1 44.45,44.55 44.45,30.1 43.55,29.2 38.35,29.2 v36.35,27.2 | 31.15,22.9 v30.95,22.7 31.2,22.95 U$2.20
  Bottom 0.254: v39.45,46.2 39.5,46.2 39.6,46.1 v42.75,46.1 | v36.35,27.2 33.95,27.2 31.95,25.2 31.95,24.1 30.95,23.1 v30.95,22.7
N$2
  Top 0.254: U$1.36 26.52,36.47 21.75,31.7 21.75,28.74 R45.2
N$3
  Top 0.254: U$1.37 27.02,35.97 R3.2
N$4
  Top 0.254: R4.2 26.28,34.23 27.52,35.47 U$1.38
N$5
  Top 0.254: R34.2 32.95,32.9 30.52,35.33 U$1.44
N$6
  Top 0.254: U$1.46 31.52,36.23 32.45,35.3 32.45,35.13 R7.2
N$7
  Top 0.254: U$1.47 32.02,36.53 32.85,35.7 33.28,35.7 R8.2
N$8
  Top 0.254: R35.2 33.95,32.7 31.02,35.63 U$1.45
N$9
  Top 0.254: U$1.34 25.52,36.77 24.95,36.2 23.96,36.2 R9.2
N$10
  Top 0.254: U$1.6 30.02,48.73 R10.2
N$11
  Top 0.64: L2.2 C20.2
N$12
  Top 0.178: U$1.54 34.55,40.6 35.35,41.4 37.75,41.4 42,45.65 42,49.2 42.4,49.6 R11.1
N$13
  Top 0.178: U$1.55 34.45,41.1 35.15,41.8 37.65,41.8 41.65,45.8 41.65,49.45 43.6,51.4 R12.1
N$14
  Top 0.178: U$1.56 34.35,41.6 34.95,42.2 37.55,42.2 41.3,45.95 41.3,49.7 44.8,53.2 R13.1
N$15
  Top 0.178: U$1.57 34.25,42.1 34.75,42.6 37.35,42.6 40.9,46.15 40.9,49.9 46,55 R14.1
N$16
  Top 0.178: U$1.58 34.2,42.6 34.6,43 37.1,43 40.5,46.4 40.5,50.1 47.2,56.8 R15.1
N$17
  Top 0.64: C2.1 D6.2 28,6.4 L5.1 X3.P
N$18
  Top 0.178: R12.2 D3.+
N$19
  Top 0.178: R14.2 D1.+
N$20
  Top 0.178: R15.2 D0.+
N$21
  Top 0.178: R13.2 51.63,53.2 D2.+
N$22
  Top 0.254: U$1.39 28.02,34.87 R16.1
N$24
  Top 0.64: C23.1 41.92,3.48 X2.P
N$25
  pour Top (no thermals): 12,61.2 12,56.9 10,56.9 10,59.4 10.3,59.7 11.3,59.7 11.7,60.1 11.7,61.2
N$26  (via drill 0.3)
  Top 0.254: 13.37,60.97 v13.4,61 13.4,60.95 U1.4 | v16.6,60.1 16.6,59.15 R1.1 C36.2 17.66,59.1 R5.2
  Bottom 0.254: v13.4,61 15.7,61 v16.6,60.1
N$27
  Top 0.406: L6.1 14.38,5.66 R2.1 16.21,5.66 C21.1
N$28
  Bottom 0.254: JP1.3 6.49,35.59 5.9,35 3.54,35 X1.24
N$29
  Top 0.254: C19.1 38.03,24.83 37.65,24.45 U$2.8
N$30
  Top 0.178: U$1.53 34.25,40.1 arc37 35.15,40.4 arc-44 R21.2
N$31
  Top 0.178: R21.1 36.79,40.63 OSC1.3
N$32
  Top 0.254: R22.2 41.56,36.76 OSC1.1
N$33
  Top 0.254: OSC1.4 39.55,36.47 R23.2 R22.1
  Top 0.406: C10.1 39.54,36.48 OSC1.4
N$34
  Top 0.406: GPS.14 R2.2
N$35
  Top 0.254: U$2.1 37.8,20.95 38.05,20.7 38.05,19.9 38.25,19.7 C11.1
N$36
  Top 0.305: C18.1 29.47,26.72 29.95,27.2 29.95,28.02 OSC2.P$4 30.04,28.02 30.04,28.24 30.7,28.9 31.1,28.9 R25.2
N$37  (via drill 0.3)
  Top 0.254: C19.2 39.06,27.19 v38.15,28.1 | v31.35,31.3 27.05,31.3 26.35,30.6 26.35,29.3 27.34,28.3 OSC2.P$3 arc-90 27.02,27.74 C34.2
  Bottom 0.254: v38.15,28.1 38.15,29.6 36.45,31.3 v31.35,31.3
N$38
  Top 0.254: U$2.25 33.2,19.9 32.6,19.3 31.92,19.3 C15.1
N$39
  Top 0.254: U$2.3 39.24,21.95 C16.1
N$40
  Top 0.254: U$2.5 37.95,22.95 38.2,23.2 39.26,23.2 C17.1
N$41
  Top 0.254: L6.2 13.27,4.93 12.6,5.6
  Top 0.406: GPS.11 11.8,7.2 arc53 12.6,5.6 arc-43 X4.P
N$42
  Top 0.64: C107.+ 14.05,20.85 D5.- 14,20.7 GPS.6
N$43
  Top 0.64: R17.1 D5.+
N$44
  Top 0.64: C20.1 C22.1 U$4.P$5
N$45
  Top 0.254: U$1.43 30.02,34.72 R18.2
N$46
  Top 0.64: C2.2 U$4.P$2
N$49
  Top 0.254: U$3.27 21.8,19.8 arc73 22.9,18.3 arc19 25.1,18 arc-31 L1.2 arc-31 30.9,18 arc19 33.1,18.3 arc73 34.2,19.8 U$2.27
  Top 0.64: L1.2 L2.1
N$52
  Top 0.254: 39.88,14.04 L3.2
  Top 0.64: 39.88,14.04 C24.1 41.24,12.73 C23.2
N$53
  Top 0.254: U$2.30 35.7,19.1 arc27 C25.1
  Top 0.406: C25.1 L3.1
N$54
  Top 0.254: U$2.29 35.2,17.27 | C26.1 35.2,16.18 35.2,17.27 | 35.2,17.27 C25.2
N$56
  Top 0.254: U$2.15 33.7,26.96 R34.1
N$57
  Top 0.254: U$2.14 34.2,27.46 R35.1
N$58
  Top 0.254: U$3.1 25.3,20.95 25.55,20.7 25.55,20.2 25.75,20 27,20 C27.1
N$59
  Top 0.254: U$3.25 20.8,19.9 20.3,19.4 19.48,19.4 C31.1
N$60
  Top 0.254: U$3.3 26.87,21.95 C32.1
N$61
  Top 0.254: C33.1 26.9,23.3 25.89,23.29 25.55,22.95 U$3.5
N$62
  Top 0.254: C34.1 25.66,25.06 arc-90 U$3.8
N$78
  Top 0.254: U$3.15 21.3,26.45 20.55,27.2 20.55,27.69 R44.1
N$79
  Top 0.254: R45.1 21.61,26.94 21.8,26.75 U$3.14
N$80
  Top 0.254: U$1.61 34.25,44.1 34.85,44.7 R33.2
N$81
  Top 0.254: U$1.62 34.05,44.6 35.05,45.6 35.6,45.6 R32.2
N$82
  Top 0.254: U$1.63 33.85,45.1 34.65,45.9 34.65,46.3 35.05,46.7 R31.2
N$83
  Top 0.254: U$1.64 33.65,45.6 34.15,46.1 34.15,46.7 35.15,47.7 R30.2
N$84
  Top 0.254: U$1.22 23.15,43.1 22.55,43.7 21.89,43.7 R43.2
N$85
  Top 0.254: U$1.21 23.35,43.6 22.55,44.4 22.2,44.4 R42.2
N$86
  Top 0.254: U$1.20 23.45,44.1 22.65,44.9 22.65,45.6 22.25,46 R41.2
N$87
  Top 0.254: U$1.19 23.55,44.6 23.15,45 23.15,46.2 22.35,47 R40.2
N$88  (via drill 0.3)
  Top 0.254: U$2.9 36.7,26.15 v36.85,26.3 | U$3.9 24.3,26.05 v24.45,26.2 24.35,26.3 24.35,29.3 v24.65,29.6 | v21.35,32.9 20.25,32.9 19.05,34.1 19.05,40.9 19.75,41.6 U$1.25
  Bottom 0.254: v36.85,26.3 33.75,26.3 32.45,25 32.45,23.8 31.55,22.9 31.55,22.4 31.25,22.1 30.35,22.1 29.55,22.9 29.55,25.1 29.25,25.4 25.25,25.4 v24.45,26.2 | v24.65,29.6 v21.35,32.9
N$89  (via drill 0.3)
  Top 0.254: U$2.11 35.7,31.9 35.85,32.05 v35.85,32 | v28.05,32.5 28.05,33.74 R16.2
  Bottom 0.254: v35.85,32 28.55,32 v28.05,32.5
N$90
  Top 0.254: U$1.35 26.02,36.67 20.51,31.16 R44.2
N$91
  Top 0.254: U$2.13 34.7,32.88 R7.1
N$92
  Top 0.254: U$3.13 22.3,31.25 R3.1
N$93
  Top 0.254: U$3.12 22.8,30.34 R4.1
N$94
  Top 0.254: U$2.12 35.2,33.78 R8.1
N$95
  Bottom 0.254: JP1.1 6.09,37.21 5.7,37.6 3.48,37.6 X1.26
N$100  (via drill 0.3)
  Top 0.254: R31.1 38,46.7 38.7,46 v38.65,46 | v42.15,45 42.75,45 43.95,43.8 43.95,30.4 43.25,29.7 37.85,29.7 v36.35,28.2 | 30.45,23.4 v30.25,23.2 30.5,23.45 U$2.19
  Bottom 0.254: v38.65,46 38.9,45.7 39,45.6 41.25,45.6 41.95,45 v42.15,45 | v36.35,28.2 34.25,28.2 31.45,25.4 31.45,24.4 v30.25,23.2
N$101  (via drill 0.3)
  Top 0.254: R32.1 37.65,45.7 v37.85,45.9 | v41.75,44.3 42.4,44.3 43.45,43.25 43.45,30.7 42.95,30.2 37.35,30.2 v36.35,29.2 | 30.35,24 v30.25,24.1 30.4,23.95 U$2.18
  Bottom 0.254: v37.85,45.9 38.65,45.1 39,45.1 40.95,45.1 v41.75,44.3 | v36.35,29.2 34.55,29.2 30.95,25.6 30.95,25 30.25,24.3 v30.25,24.1
N$102  (via drill 0.3)
  Top 0.254: R33.1 37.15,44.7 v37.55,45.1 | v41.15,43.8 41.2,43.8 41.5,43.5 42.35,43.5 42.95,42.9 42.95,31 42.65,30.7 36.85,30.7 v36.35,30.2 | v30.35,25.3 30.35,25 30.9,24.45 U$2.17
  Bottom 0.254: v37.55,45.1 38.15,44.5 38.4,44.5 38.3,44.5 40.45,44.5 v41.15,43.8 | v36.35,30.2 34.85,30.2 30.35,25.7 v30.35,25.3
N$103
  Top 0.254: R40.1 18.25,47 16.25,45 16.25,24.6 17.9,22.95 U$3.20
N$104
  Top 0.254: R41.1 18.45,46 16.85,44.4 16.85,24.9 18.3,23.45 U$3.19
N$105
  Top 0.254: R42.1 18.65,45 17.45,43.8 17.45,25.1 18.6,23.95 U$3.18
N$106
  Top 0.254: R43.1 18.75,44 18.05,43.3 18.05,25.4 18.9,24.45 U$3.17
PPS  (via drill 0.3)
  Top 0.254: U$1.9 28.52,48.03 28.25,48.3 28.25,50.35 28,50.6 25.4,50.6 | 25.4,50.6 11.8,50.6 10.8,49.6 10.8,44.1 v11,43.9 v11,34 | R20.2 25.08,50.28 25.4,50.6 | v15,30.1 15,19.3 16.3,18 16.3,17 GPS.4
  Bottom 0.254: v11,43.9 4.8,43.9 X1.29 | v11,34 v15,30.1
RST
  Top 0.254: U$1.1 32.52,46.72 32.9,47.1 32.9,48 | 32.9,48 32.9,51.7 31.5,53.1 10.3,53.1 7.8,50.6 7.8,38.3 7.1,37.6 3.9,37.6 3.5,37.2 3.5,35.04 X1.22 | R6.1 32.9,48
SCK
  Top 0.254: U$1.2 32.02,47.02 32.4,47.4 32.4,51.5 31.3,52.6 10.6,52.6 8.4,50.4 8.4,37.3 7.5,36.4 4.86,36.4 X1.23

### Text on the board
tPlace: TX_ON | FSK_PKT | BH_PKT | SENSOR_PKT | RX_BUF_NOT_EMPTY | Channel B | Channel A | GPS | RX | TX
bPlace: 1 | CS | 0
tNames: LoRa Board for Raspberry Pi V1.2 / design by Will Whang / 2017/10/13